# EAGLE schematic valves card (EAGLE 9.6.2)
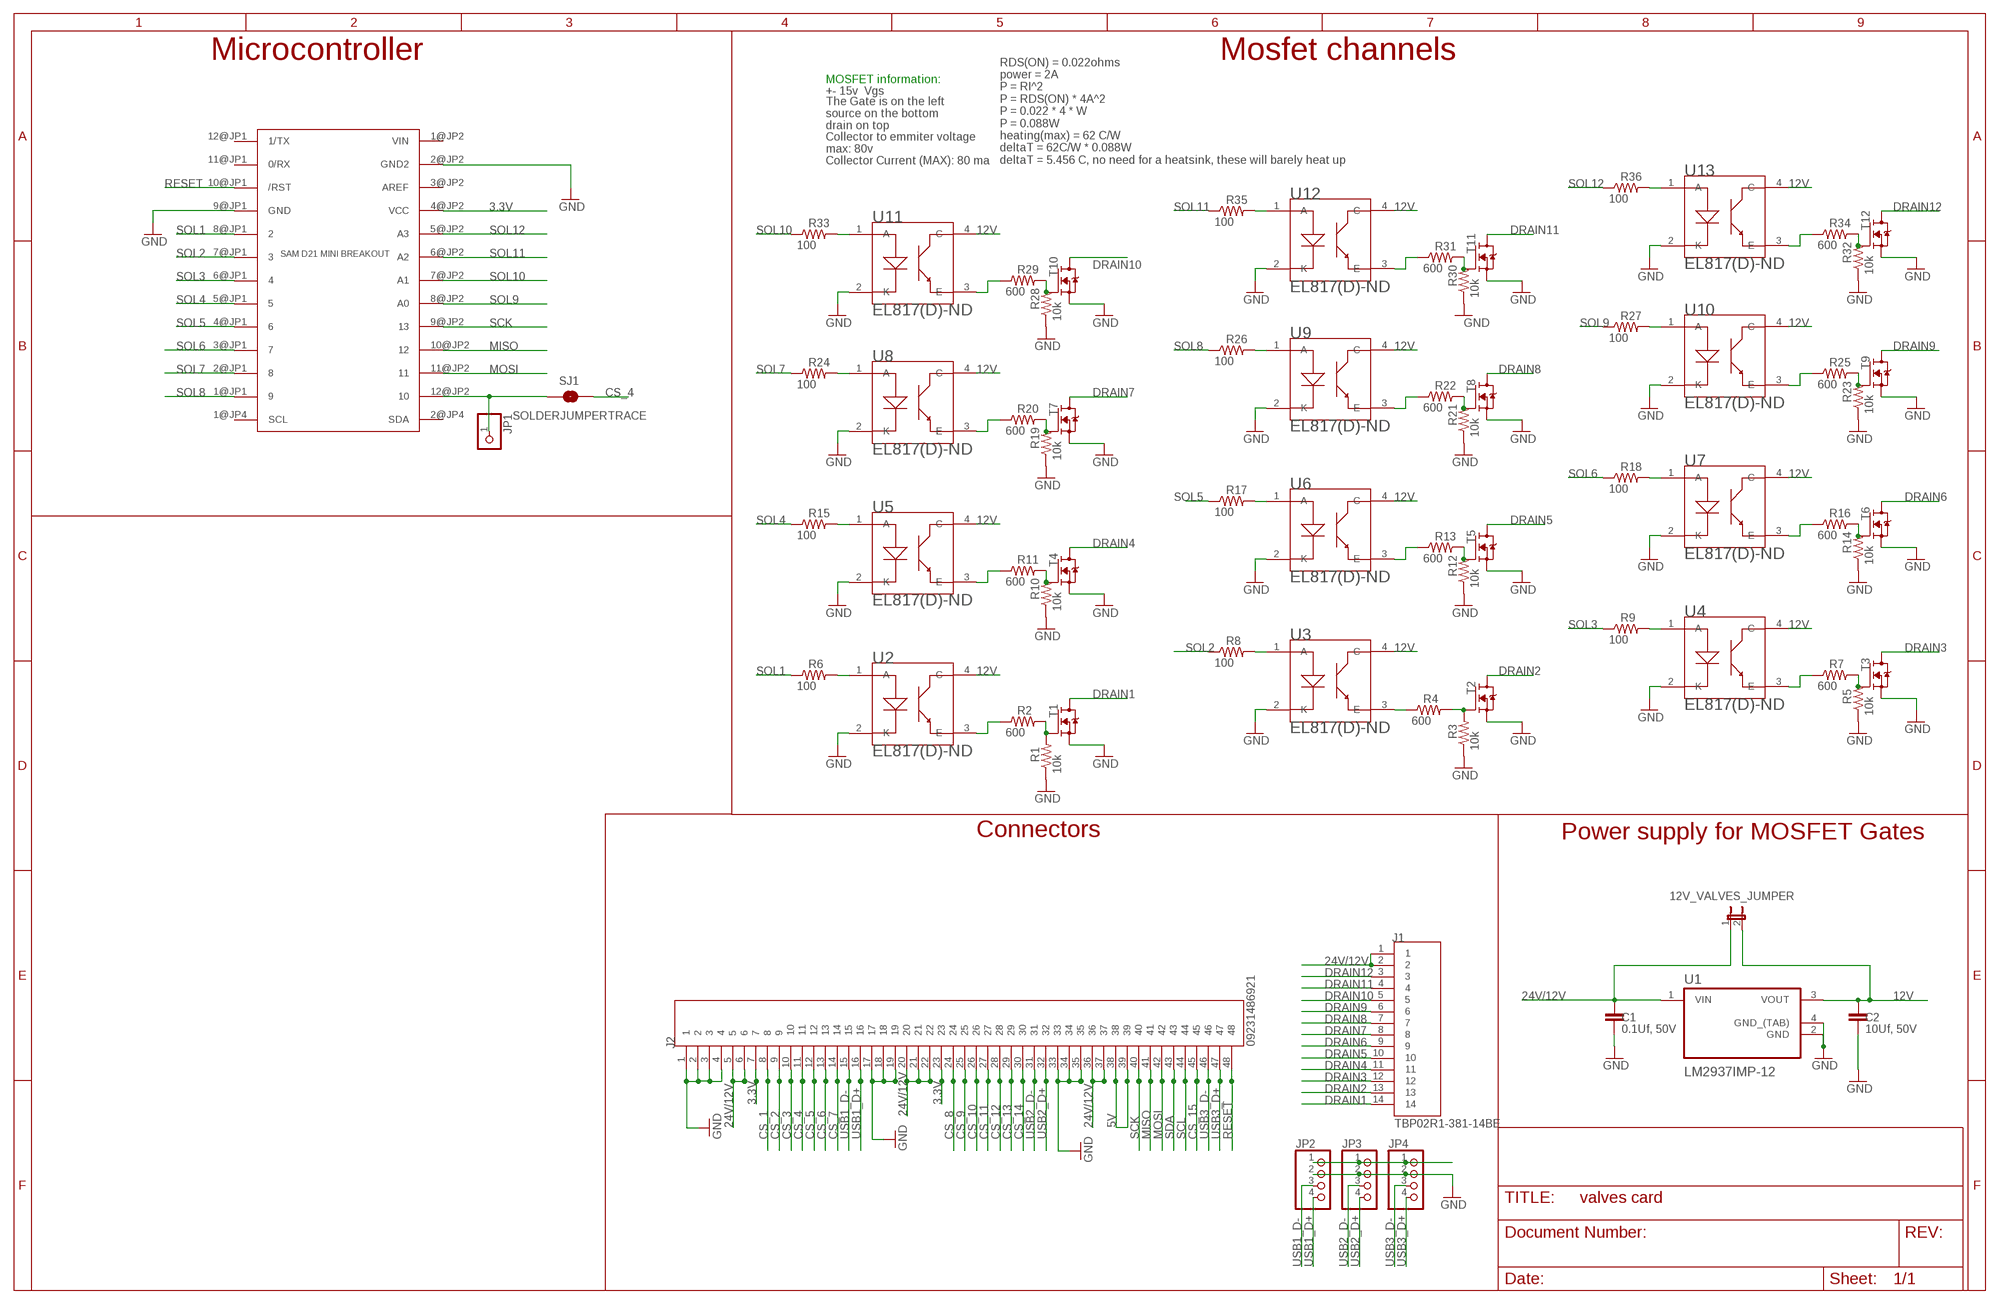
[diagram p0: schematic, sheet 1]

## Parts
12V_VALVES_JUMPER  JUMPER-2SMD-NO  [SJ_2S-NO]
C1  0.1Uf, 50V  CAP0805  [0805]
C2  10Uf, 50V  CAP0805  [0805]
J1  TBP02R1-381-14BE  [CUI_TBP02R1-381-14BE]
J2  09231486921  [HARTING_09231486921]
JP1  PINHD-1X1  [1X01]
JP2  PINHD-1X4  [1X04]
JP3  PINHD-1X4  [1X04]
JP4  PINHD-1X4  [1X04]
M2  SAM_D21_MINI_BREAKOUT  [JP1_SPARKFUN-SAMD21-MINI-BREAKOUT-V10]
R1  10k  RESISTOR0805-RES  [0805]
R2  600  RESISTOR0805-RES  [0805]
R3  10k  RESISTOR0805-RES  [0805]
R4  600  RESISTOR0805-RES  [0805]
R5  10k  RESISTOR0805-RES  [0805]
R6  100  RESISTOR0805-RES  [0805]
R7  600  RESISTOR0805-RES  [0805]
R8  100  RESISTOR0805-RES  [0805]
R9  100  RESISTOR0805-RES  [0805]
R10  10k  RESISTOR0805-RES  [0805]
R11  600  RESISTOR0805-RES  [0805]
R12  10k  RESISTOR0805-RES  [0805]
R13  600  RESISTOR0805-RES  [0805]
R14  10k  RESISTOR0805-RES  [0805]
R15  100  RESISTOR0805-RES  [0805]
R16  600  RESISTOR0805-RES  [0805]
R17  100  RESISTOR0805-RES  [0805]
R18  100  RESISTOR0805-RES  [0805]
R19  10k  RESISTOR0805-RES  [0805]
R20  600  RESISTOR0805-RES  [0805]
R21  10k  RESISTOR0805-RES  [0805]
R22  600  RESISTOR0805-RES  [0805]
R23  10k  RESISTOR0805-RES  [0805]
R24  100  RESISTOR0805-RES  [0805]
R25  600  RESISTOR0805-RES  [0805]
R26  100  RESISTOR0805-RES  [0805]
R27  100  RESISTOR0805-RES  [0805]
R28  10k  RESISTOR0805-RES  [0805]
R29  600  RESISTOR0805-RES  [0805]
R30  10k  RESISTOR0805-RES  [0805]
R31  600  RESISTOR0805-RES  [0805]
R32  10k  RESISTOR0805-RES  [0805]
R33  100  RESISTOR0805-RES  [0805]
R34  600  RESISTOR0805-RES  [0805]
R35  100  RESISTOR0805-RES  [0805]
R36  100  RESISTOR0805-RES  [0805]
SJ1  SOLDERJUMPERTRACE  [SJ_2S-TRACE]
T1  IRLZ44NSTRLPBF  BUK9214-30A-118-DPAK  [DPAK_TO252]
T2  IRLZ44NSTRLPBF  BUK9214-30A-118-DPAK  [DPAK_TO252]
T3  IRLZ44NSTRLPBF  BUK9214-30A-118-DPAK  [DPAK_TO252]
T4  IRLZ44NSTRLPBF  BUK9214-30A-118-DPAK  [DPAK_TO252]
T5  IRLZ44NSTRLPBF  BUK9214-30A-118-DPAK  [DPAK_TO252]
T6  IRLZ44NSTRLPBF  BUK9214-30A-118-DPAK  [DPAK_TO252]
T7  IRLZ44NSTRLPBF  BUK9214-30A-118-DPAK  [DPAK_TO252]
T8  IRLZ44NSTRLPBF  BUK9214-30A-118-DPAK  [DPAK_TO252]
T9  IRLZ44NSTRLPBF  BUK9214-30A-118-DPAK  [DPAK_TO252]
T10  IRLZ44NSTRLPBF  BUK9214-30A-118-DPAK  [DPAK_TO252]
T11  IRLZ44NSTRLPBF  BUK9214-30A-118-DPAK  [DPAK_TO252]
T12  IRLZ44NSTRLPBF  BUK9214-30A-118-DPAK  [DPAK_TO252]
U1  LM2937IMP-12  [SOT230P700X180-4N]
U2  EL817(D)-ND  EL817(D)  [DIP4]
U3  EL817(D)-ND  EL817(D)  [DIP4]
U4  EL817(D)-ND  EL817(D)  [DIP4]
U5  EL817(D)-ND  EL817(D)  [DIP4]
U6  EL817(D)-ND  EL817(D)  [DIP4]
U7  EL817(D)-ND  EL817(D)  [DIP4]
U8  EL817(D)-ND  EL817(D)  [DIP4]
U9  EL817(D)-ND  EL817(D)  [DIP4]
U10  EL817(D)-ND  EL817(D)  [DIP4]
U11  EL817(D)-ND  EL817(D)  [DIP4]
U12  EL817(D)-ND  EL817(D)  [DIP4]
U13  EL817(D)-ND  EL817(D)  [DIP4]

## Nets
3.3V: J2.7 J2.23 M2.4@JP2(VCC)
5V: J2.38 J2.39 JP2.1 JP3.1 JP4.1
12V: 12V_VALVES_JUMPER.2 C2.1 U1.3(VOUT) U2.4(C) U3.4(C) U4.4(C) U5.4(C) U6.4(C) U7.4(C) U8.4(C) U9.4(C) U10.4(C) U11.4(C) U12.4(C) U13.4(C)
24V/12V: 12V_VALVES_JUMPER.1 C1.1 J1.1 J1.2 J2.5 J2.6 J2.20 J2.21 J2.22 J2.36 J2.37 U1.1(VIN)
CS_1: J2.8
CS_2: J2.9
CS_3: J2.10
CS_4: J2.11 SJ1.2
CS_5: J2.12
CS_6: J2.13
CS_7: J2.14
CS_8: J2.24
CS_9: J2.25
CS_10: J2.26
CS_11: J2.27
CS_12: J2.28
CS_13: J2.29
CS_14: J2.30
CS_15: J2.45
DRAIN1: J1.14 T1.2(D)
DRAIN2: J1.13 T2.2(D)
DRAIN3: J1.12 T3.2(D)
DRAIN4: J1.11 T4.2(D)
DRAIN5: J1.10 T5.2(D)
DRAIN6: J1.9 T6.2(D)
DRAIN7: J1.8 T7.2(D)
DRAIN8: J1.7 T8.2(D)
DRAIN9: J1.6 T9.2(D)
DRAIN10: J1.5 T10.2(D)
DRAIN11: J1.4 T11.2(D)
DRAIN12: J1.3 T12.2(D)
GND: C1.2 C2.2 J2.1 J2.2 J2.3 J2.4 J2.17 J2.18 J2.19 J2.33 J2.34 J2.35 JP2.2 JP3.2 JP4.2 M2.2@JP2(GND2) M2.9@JP1(GND) R1.1 R3.1 R5.1 R10.1 R12.1 R14.1 R19.1 R21.1 R23.1 R28.1 R30.1 R32.1 T1.3(S) T2.3(S) T3.3(S) T4.3(S) T5.3(S) T6.3(S) T7.3(S) T8.3(S) T9.3(S) T10.3(S) T11.3(S) T12.3(S) U1.2(GND) U1.4(GND_(TAB)) U2.2(K) U3.2(K) U4.2(K) U5.2(K) U6.2(K) U7.2(K) U8.2(K) U9.2(K) U10.2(K) U11.2(K) U12.2(K) U13.2(K)
MISO: J2.41 M2.10@JP2
MOSI: J2.42 M2.11@JP2
N$2: JP1.1 M2.12@JP2 SJ1.1
N$5: R6.2 U2.1(A)
N$10: R1.2 R2.2 T1.1(G)
N$11: R2.1 U2.3(E)
N$15: R3.2 R4.2 T2.1(G)
N$16: R4.1 U3.3(E)
N$17: R8.2 U3.1(A)
N$21: R5.2 R7.2 T3.1(G)
N$22: R7.1 U4.3(E)
N$23: R9.2 U4.1(A)
N$27: R10.2 R11.2 T4.1(G)
N$28: R11.1 U5.3(E)
N$29: R15.2 U5.1(A)
N$33: R12.2 R13.2 T5.1(G)
N$34: R13.1 U6.3(E)
N$35: R17.2 U6.1(A)
N$39: R14.2 R16.2 T6.1(G)
N$40: R16.1 U7.3(E)
N$41: R18.2 U7.1(A)
N$45: R19.2 R20.2 T7.1(G)
N$46: R20.1 U8.3(E)
N$47: R24.2 U8.1(A)
N$51: R21.2 R22.2 T8.1(G)
N$52: R22.1 U9.3(E)
N$53: R26.2 U9.1(A)
N$57: R23.2 R25.2 T9.1(G)
N$58: R25.1 U10.3(E)
N$59: R27.2 U10.1(A)
N$63: R28.2 R29.2 T10.1(G)
N$64: R29.1 U11.3(E)
N$65: R33.2 U11.1(A)
N$69: R30.2 R31.2 T11.1(G)
N$70: R31.1 U12.3(E)
N$71: R35.2 U12.1(A)
N$75: R32.2 R34.2 T12.1(G)
N$76: R34.1 U13.3(E)
N$77: R36.2 U13.1(A)
RESET: J2.48 M2.10@JP1(/RST)
SCK: J2.40 M2.9@JP2
SCL: J2.44
SDA: J2.43
SOL1: M2.8@JP1 R6.1
SOL2: M2.7@JP1 R8.1
SOL3: M2.6@JP1 R9.1
SOL4: M2.5@JP1 R15.1
SOL5: M2.4@JP1 R17.1
SOL6: M2.3@JP1 R18.1
SOL7: M2.2@JP1 R24.1
SOL8: M2.1@JP1 R26.1
SOL9: M2.8@JP2(A0) R27.1
SOL10: M2.7@JP2(A1) R33.1
SOL11: M2.6@JP2(A2) R35.1
SOL12: M2.5@JP2(A3) R36.1
USB1_D+: J2.16 JP2.4
USB1_D-: J2.15 JP2.3
USB2_D+: J2.32 JP3.4
USB2_D-: J2.31 JP3.3
USB3_D+: J2.47 JP4.4
USB3_D-: J2.46 JP4.3
Unconnected: M2.1@JP4(SCL) M2.2@JP4(SDA) M2.11@JP1(0/RX) M2.12@JP1(1/TX)

## Notes on the sheet
- Microcontroller | Mosfet channels
- MOSFET information:
- +- 15v  Vgs
- The Gate is on the left
  source on the bottom
  drain on top
- Collector to emmiter voltage 
  max: 80v
- Collector Current (MAX): 80 ma
- RDS(ON) = 0.022ohms
  power = 2A
  P = RI^2
  P = RDS(ON) * 4A^2
  P = 0.022 * 4 * W
  P = 0.088W
  heating(max) = 62 C/W
  deltaT = 62C/W * 0.088W
  deltaT = 5.456 C, no need for a heatsink, these will barely heat up
- Connectors | Power supply for MOSFET Gates

## Power pins joined to a net without a drawn wire
AREF: M2.3@JP2(AREF)
VIN: M2.1@JP2(VIN)

## Library data of the parts
12V_VALVES_JUMPER = SparkFun-Passives:JUMPER-2: Jumper Basic 0.1" spaced jumper. Use with breakaway headers.
C1 C2 = SparkFun-Passives:CAP: Capacitor Standard 0603 ceramic capacitor, and 0.1" leaded capacitor.; MANUFACTURER-PART-NUMBER: Generic; PACKAGE: 0805; SIMILAR-COMPONENTS: Other generic 0805 capacitors
J1 = TBP02R1-381-14BE:TBP02R1-381-14BE: Check prices <https://pricing.snapeda.com/parts/TBP02R1-381-14BE/CUI%20Devices/view-part?ref=eda>; MANUFACTURER-PART-NUMBER: TBP02R1-381-14BE; PACKAGE: None
J2 = din41612_48_pin_board:09231486921: Check prices <https://pricing.snapeda.com/parts/8-1393644-0/TE%20Connectivity/view-part?ref=eda>; MANUFACTURER-PART-NUMBER: 09231486921; PACKAGE: None
JP1 = pinhead:PINHD-1X1: PIN HEADER
JP2-JP4 = pinhead:PINHD-1X4: PIN HEADER
M2 = SparkFun-SAMD21-Mini-Breakout:SAM_D21_MINI_BREAKOUT: SPARKFUN-SAMD21-MINI-BREAKOUT; MANUFACTURER-PART-NUMBE: SparkFun SAMD21 mini breakout, SLW-112-01-G-S < buy two of these; PACKAGE: None; SIMILAR-COMPONENTS: None, https://www.adafruit.com/product/3008
R1-R36 = SparkFun-Passives:RESISTOR: Resistor Basic schematic elements and footprints for 0603, 1206, and PTH resistors.; MANUFACTURER-PART-NUMBER: Generic; PACKAGE: 0805; SIMILAR-COMPONENTS: Generic 0805 resistors
SJ1 = SparkFun-Passives:SOLDERJUMPER: Solder Jumper Standard SMD solder jumper. Used to automate production. Two varients : Normally Open and Normally Closed are the same, but have different paste layers. NC will have a large amount of paste and should jumper during reflow.
T1-T12 = BUK9214-30A,118:BUK9214-30A-118: N-Channel MOSFET SOT23 N-Chn MOSFET TSM3404, IRLML2502 (Vgs>=+/-20V, Vds<=20V, Id>=3A + Rds<=0.05Ohm @ Vgs=4.5V) BSS138 (Vgs>=+/-20V, Vds<=40V, Id>=0.2A + Rds<=3Ohm @ Vgs=4.5V) SOT223 Low Side Switch with Protection (Infineon) BSP76 (Vin=0...10V, Vds<=42V, Id=1.4A + Rds=0.2Ohm @ Vin=5V) BSP77 (Vin=0...10V, Vds<=42V, Id=2.2A + Rds=0.1Ohm @ Vin=5V) D²Pak Low Side Switch with Protection (Infineon) BTS117TC (Vin=0...10V, Vds<=60V, Id=3.5A + Rds=0.12Ohm @ Vin=5V) BTS133TC (Vin=0...10V, Vds<=60V, Id=7A + Rds=0.06Ohm @ Vin=5V) BTS141TC (Vin=0...10V, Vds<=60V, Id=12A + Rds=0.03Ohm @ Vin=5V) BTS3018TC (Vin=0...10V, Vds<=60V, Id=6A + Rds=0.02Ohm @ Vin=5V); DEVICE: BUK9214-30A,118; PACKAGE: DPAK
U1 = LM2937IMP-10:LM2937IMP-12: Check prices <https://pricing.snapeda.com/parts/LM2937IMP-10/Texas%20Instruments/view-part?ref=eda>; MANUFACTURER-PART-NUMBER: LM2937IMP-12; PACKAGE: SOT-223-4 Texas Instruments
U2-U13 = EL817(D):EL817(D): Optocoupler DC-IN 1-CH Transistor DC-OUT 4-Pin PDIP Tube Check prices <https://pricing.snapeda.com/search/part/EL817%28C%29/?ref=eda>; MANUFACTURER-PART-NUMBER: EL817(D); PACKAGE: dip4; SIMILAR-COMPONENTS: OR-815,

## Net classes
1 POWER: clearance 0.508 mm